# Altium schematic sheet Sensors_Interface.SchDoc
size A4; SheetNumber: 3; SheetTotal: 8
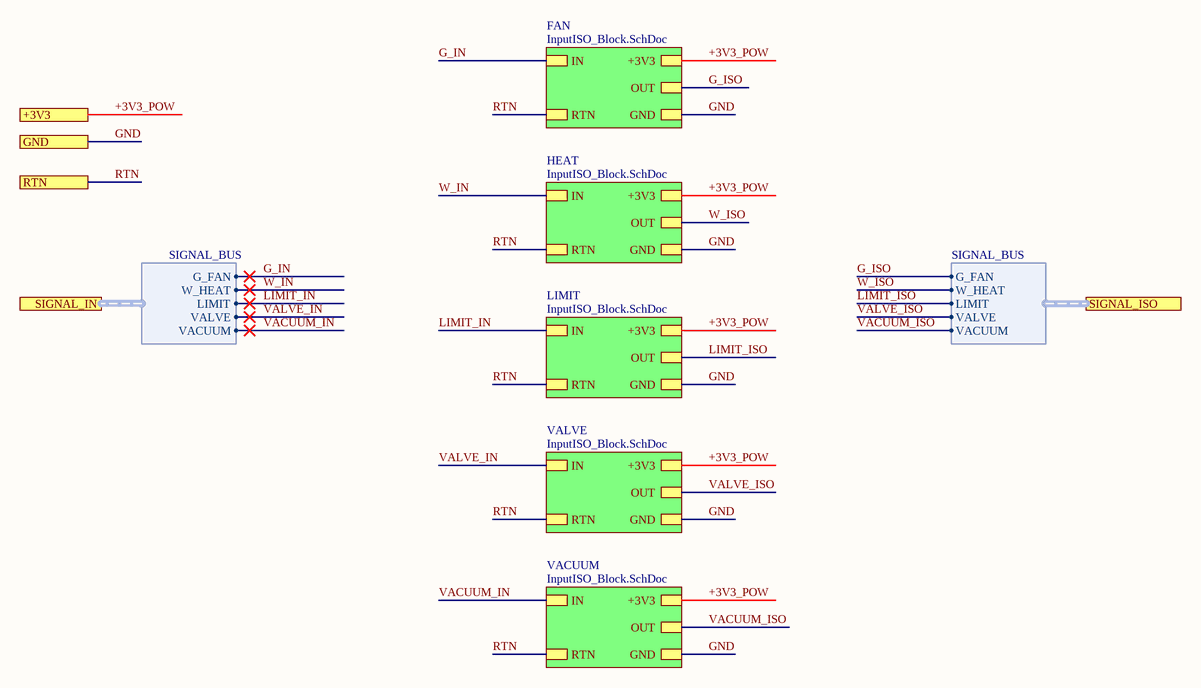
[diagram p0: Sensors_Interface.SchDoc]

## Sub-sheets
FAN = InputISO_Block.SchDoc: +3V3, OUT, IN, RTN, GND
HEAT = InputISO_Block.SchDoc: +3V3, OUT, IN, RTN, GND
LIMIT = InputISO_Block.SchDoc: +3V3, OUT, IN, RTN, GND
VACUUM = InputISO_Block.SchDoc: +3V3, OUT, IN, RTN, GND
VALVE = InputISO_Block.SchDoc: +3V3, OUT, IN, RTN, GND

## Ports
+3V3, GND, RTN, SIGNAL_IN (harness SIGNAL_BUS), SIGNAL_ISO (harness SIGNAL_BUS)

## Harnesses
SIGNAL_BUS: G_FAN, W_HEAT, LIMIT, VACUUM, VALVE
SIGNAL_BUS: G_FAN, LIMIT, VACUUM, VALVE, W_HEAT

## Nets
+3V3_POW: port +3V3, sheet FAN/+3V3, sheet HEAT/+3V3, sheet LIMIT/+3V3, sheet VALVE/+3V3, sheet VACUUM/+3V3
G_IN: sheet FAN/IN, port SIGNAL_IN.G_FAN
G_ISO: sheet FAN/OUT, port SIGNAL_ISO.G_FAN
GND: port GND, sheet FAN/GND, sheet HEAT/GND, sheet LIMIT/GND, sheet VALVE/GND, sheet VACUUM/GND
LIMIT_IN: sheet LIMIT/IN, port SIGNAL_IN.LIMIT
LIMIT_ISO: sheet LIMIT/OUT, port SIGNAL_ISO.LIMIT
RTN: port RTN, sheet FAN/RTN, sheet HEAT/RTN, sheet LIMIT/RTN, sheet VALVE/RTN, sheet VACUUM/RTN
VACUUM_IN: sheet VACUUM/IN, port SIGNAL_IN.VACUUM
VACUUM_ISO: sheet VACUUM/OUT, port SIGNAL_ISO.VACUUM
VALVE_IN: sheet VALVE/IN, port SIGNAL_IN.VALVE
VALVE_ISO: sheet VALVE/OUT, port SIGNAL_ISO.VALVE
W_IN: sheet HEAT/IN, port SIGNAL_IN.W_HEAT
W_ISO: sheet HEAT/OUT, port SIGNAL_ISO.W_HEAT